# Altium project MotionControlBoard.PrjPcb
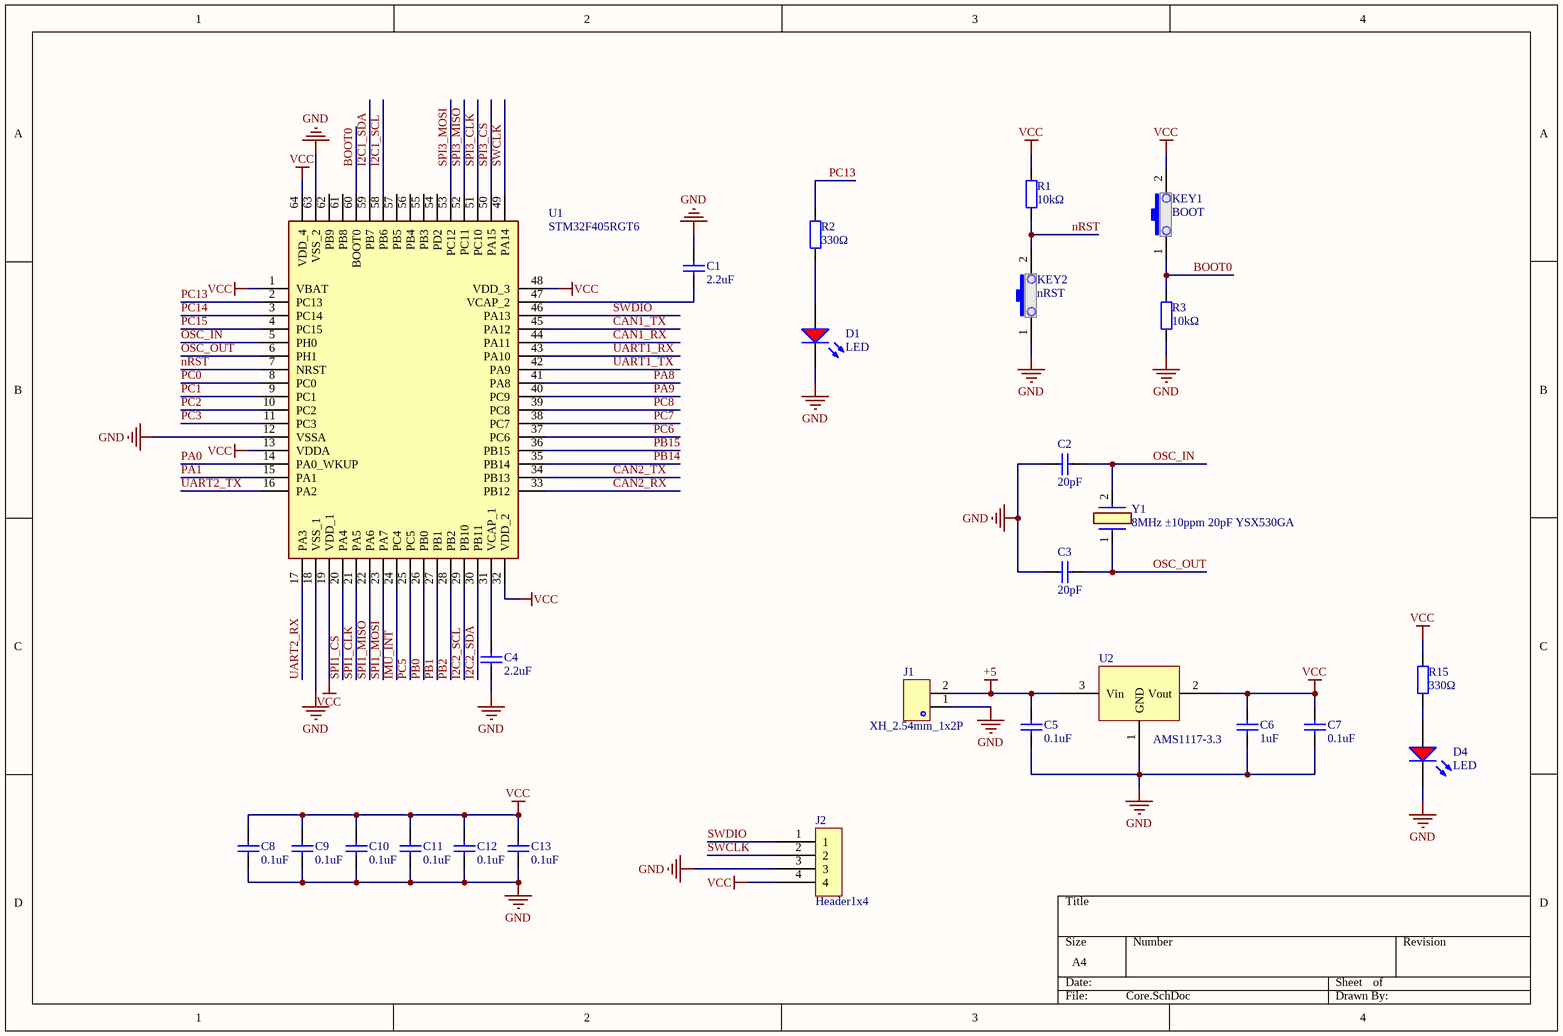
[diagram p0: Core.SchDoc]
3 sheets, 72 parts. Net scope: global (net labels, ports and power ports of the same name join across sheets).
Board file: MotionControlBoard.PcbDoc
Sheets:
  Core.SchDoc
  IMU.SchDoc
  Peripherals.SchDoc

## Sheet Core.SchDoc
size A4; SheetNumber: 1; SheetTotal: 3

### Parts
C1  2.2uF  [C0603]
C2  20pF  [C0603]
C3  20pF  [C0603]
C4  2.2uF  [C0603]
C5  0.1uF  [C0603]
C6  1uF  [C0603]
C7  0.1uF  [C0603]
C8  0.1uF  [C0603]
C9  0.1uF  [C0603]
C10  0.1uF  [C0603]
C11  0.1uF  [C0603]
C12  0.1uF  [C0603]
C13  0.1uF  [C0603]
D1  LED  [0603_LED_S1]
D4  LED  [0603_LED_S1]
J1  XH_2.54mm_1x2P  [XH2.54mm1x2P弯插]
J2  Header1x4  [Header 1x4p]
KEY1  BOOT  [KEY_3*4]
KEY2  nRST  [KEY_3*4]
R1  10kΩ  [R0603]
R2  330Ω  [R0603]
R3  10kΩ  [R0603]
R15  330Ω  [R0603]
U1  STM32F405RGT6  [QFP50P1200X1200X160-64N]
U2  AMS1117-3.3  [SOT-223]
Y1  8MHz ±10ppm 20pF YSX530GA  [X503212MSB2GI]

### Nets
+5: C5.2 J1.2 U2.3(Vin)
GND: C1.2 C2.2 C3.2 C4.2 C5.1 C6.1 C7.1 C8.1 C9.1 C10.1 C11.1 C12.1 C13.1 D1.K D4.K J1.1 J2.3 KEY2.1 R3.1 U1.12(VSSA) U1.18(VSS_1) U1.63(VSS_2) U2.1(GND)
VCC: C6.2 C7.2 C8.2 C9.2 C10.2 C11.2 C12.2 C13.2 J2.4 KEY1.2 R1.2 R15.1 U1.1(VBAT) U1.13(VDDA) U1.19(VDD_1) U1.32(VDD_2) U1.48(VDD_3) U1.64(VDD_4) U2.2(Vout)
BOOT0: KEY1.1 R3.2 U1.60(BOOT0)
CAN1_RX: U1.44(PA11)
CAN1_TX: U1.45(PA12)
CAN2_RX: U1.33(PB12)
CAN2_TX: U1.34(PB13)
I2C1_SCL: U1.58(PB6)
I2C1_SDA: U1.59(PB7)
I2C2_SCL: U1.29(PB10)
I2C2_SDA: U1.30(PB11)
IMU_INT: U1.24(PC4)
nRST: KEY2.2 R1.1 U1.7(NRST)
OSC_IN: C2.1 U1.5(PH0) Y1.2
OSC_OUT: C3.1 U1.6(PH1) Y1.1
PA0: U1.14(PA0_WKUP)
PA1: U1.15(PA1)
PA8: U1.41(PA8)
PA9: U1.40(PC9)
PB0: U1.26(PB0)
PB1: U1.27(PB1)
PB2: U1.28(PB2)
PB14: U1.35(PB14)
PB15: U1.36(PB15)
PC0: U1.8(PC0)
PC1: U1.9(PC1)
PC2: U1.10(PC2)
PC3: U1.11(PC3)
PC5: U1.25(PC5)
PC6: U1.37(PC6)
PC7: U1.38(PC7)
PC8: U1.39(PC8)
PC13: R2.1 U1.2(PC13)
PC14: U1.3(PC14)
PC15: U1.4(PC15)
SPI1_CLK: U1.21(PA5)
SPI1_CS: U1.20(PA4)
SPI1_MISO: U1.22(PA6)
SPI1_MOSI: U1.23(PA7)
SPI3_CLK: U1.51(PC10)
SPI3_CS: U1.50(PA15)
SPI3_MISO: U1.52(PC11)
SPI3_MOSI: U1.53(PC12)
SWCLK: J2.2 U1.49(PA14)
SWDIO: J2.1 U1.46(PA13)
UART1_RX: U1.43(PA10)
UART1_TX: U1.42(PA9)
UART2_RX: U1.17(PA3)
UART2_TX: U1.16(PA2)
NetC1_1: C1.1 U1.47(VCAP_2)
NetC4_1: C4.1 U1.31(VCAP_1)
NetD1_A: D1.A R2.2
NetD4_A: D4.A R15.2

Not connected (* = marked no-connect by the designer): U1 54(PD2) 55(PB3) 56(PB4) 57(PB5) 61(PB8) 62(PB9)

### Library data of the parts
C1-C13 = Capacitor
D1 D4 = 0603 红灯: 发光二极管; ComponentLink1Description: 供应商链接; ComponentLink1URL: http://www.szlcsc.com/product/details_2659.html; Package: 0603; Supplier: LC; SuppliersPartNumber: C2286
KEY1 KEY2 = KEY_3*4: C707339
R1-R3 R15 = Resistor
U1 = STM32F405RGT6TR: Integrated Circuit; Manufacturer_Name: STMicroelectronics; Datasheet Link: http://www.st.com/web/en/resource/technical/document/datasheet/DM00037051.pdf; Height: 1.6mm; Manufacturer_Part_Number: STM32F405RGT6TR; Mouser Part Number: 511-STM32F405RGT6TR; Mouser Price/Stock: https://www.mouser.co.uk/ProductDetail/STMicroelectronics/STM32F405RGT6TR?qs=MavH1QghrkHshpR6GkvPIg%3D%3D; Arrow Part Number: STM32F405RGT6TR; Arrow Price/Stock: https://www.arrow.com/en/products/stm32f405rgt6tr/stmicroelectronics?region=nac
U2 = AMS1117-3.3: C347222
Y1 = X503212MSB2GI: Crystal or Oscillator; Manufacturer_Name: Yangxing Tech; Datasheet Link: https://datasheet.lcsc.com/szlcsc/Yangxing-Tech-X503212MSB2GI_C112573.pdf; Height: 1.35mm; Manufacturer_Part_Number: X503212MSB2GI

## Sheet IMU.SchDoc
size A4; SheetNumber: 2; SheetTotal: 3
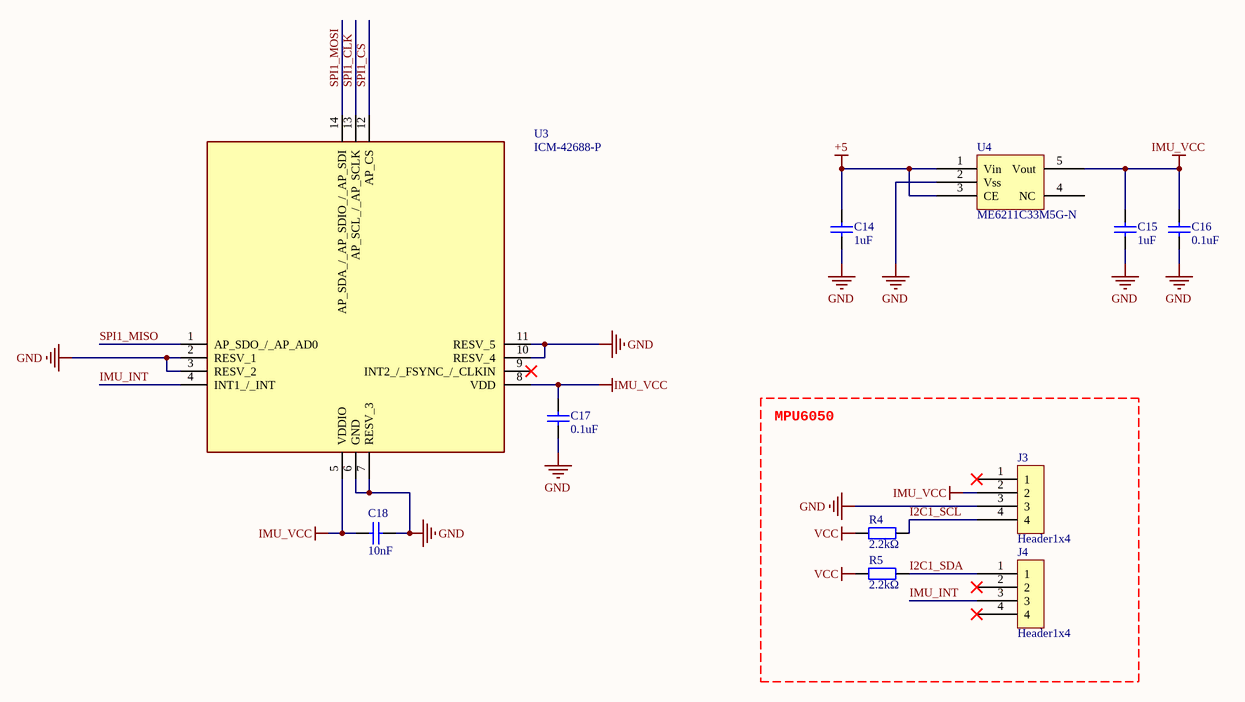
[diagram p1: IMU.SchDoc]

### Parts
C14  1uF  [C0603]
C15  1uF  [C0603]
C16  0.1uF  [C0603]
C17  0.1uF  [C0603]
C18  10nF  [C0603]
J3  Header1x4  [Header 1x4p]
J4  Header1x4  [Header 1x4p]
R4  2.2kΩ  [R0603]
R5  2.2kΩ  [R0603]
U3  ICM-42688-P  [IIM42352]
U4  ME6211C33M5G-N  [SOT-23-5]

### Blocks framed on the sheet
MPU6050: J3 J4 R4 R5

### Nets
+5: C14.2 U4.1(Vin) U4.3(CE)
GND: C14.1 C15.1 C16.1 C17.1 C18.1 J3.3 U3.2(RESV_1) U3.3(RESV_2) U3.6(GND) U3.7(RESV_3) U3.10(RESV_4) U3.11(RESV_5) U4.2(Vss)
IMU_VCC: C15.2 C16.2 C17.2 C18.2 J3.2 U3.5(VDDIO) U3.8(VDD) U4.5(Vout)
VCC: R4.2 R5.2
I2C1_SCL: J3.4 R4.1
I2C1_SDA: J4.1 R5.1
IMU_INT: J4.3 U3.4(INT1_/_INT)
SPI1_CLK: U3.13(AP_SCL_/_AP_SCLK)
SPI1_CS: U3.12(AP_CS)
SPI1_MISO: U3.1(AP_SDO_/_AP_AD0)
SPI1_MOSI: U3.14(AP_SDA_/_AP_SDIO_/_AP_SDI)

Not connected (* = marked no-connect by the designer): J3 1*; J4 2* 4*; U3 9(INT2_/_FSYNC_/_CLKIN)*; U4 4(NC)

### Library data of the parts
C14-C18 = Capacitor
R4 R5 = Resistor
U3 = ICM-42688-P: Integrated Circuit; Manufacturer_Name: TDK; Datasheet Link: https://3cfeqx1hf82y3xcoull08ihx-wpengine.netdna-ssl.com/wp-content/uploads/2021/06/DS-000347-ICM-42688-P-v1.5.pdf; Manufacturer_Part_Number: ICM-42688-P; Mouser Part Number: 410-ICM-42688-P; Mouser Price/Stock: https://www.mouser.co.uk/ProductDetail/TDK-InvenSense/ICM-42688-P?qs=OlC7AqGiEDk8QrNAV728zw%3D%3D; Arrow Part Number: ICM-42688-P; Arrow Price/Stock: https://www.arrow.com/en/products/icm-42688-p/invensense?region=nac
U4 = ME6211C33M5G-N: C82942

## Sheet Peripherals.SchDoc
size A4; SheetNumber: 3; SheetTotal: 3
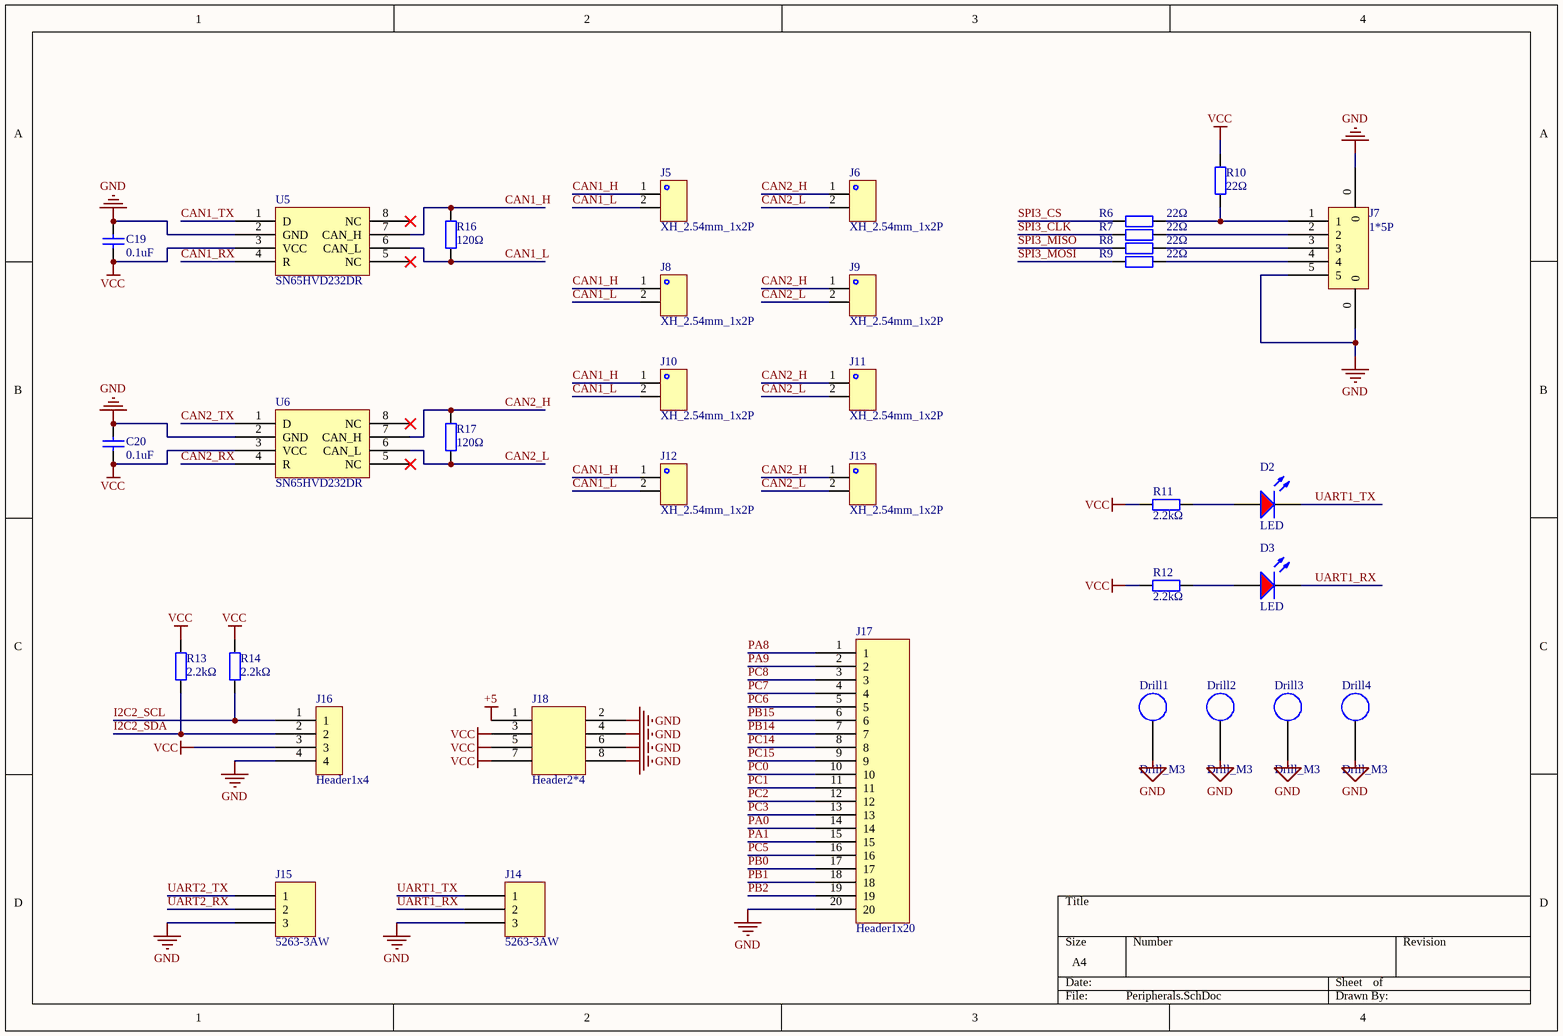
[diagram p2: Peripherals.SchDoc]

### Parts
C19  0.1uF  [C0603]
C20  0.1uF  [C0603]
D2  LED  [0603_LED_S1]
D3  LED  [0603_LED_S1]
Drill1  Drill_M3  [Drill_M_3]
Drill2  Drill_M3  [Drill_M_3]
Drill3  Drill_M3  [Drill_M_3]
Drill4  Drill_M3  [Drill_M_3]
J5  XH_2.54mm_1x2P  [XH2.54mm1x2P弯插]
J6  XH_2.54mm_1x2P  [XH2.54mm1x2P弯插]
J7  1*5P  [1.0T-5P]
J8  XH_2.54mm_1x2P  [XH2.54mm1x2P弯插]
J9  XH_2.54mm_1x2P  [XH2.54mm1x2P弯插]
J10  XH_2.54mm_1x2P  [XH2.54mm1x2P弯插]
J11  XH_2.54mm_1x2P  [XH2.54mm1x2P弯插]
J12  XH_2.54mm_1x2P  [XH2.54mm1x2P弯插]
J13  XH_2.54mm_1x2P  [XH2.54mm1x2P弯插]
J14  5263-3AW  [5264-3AW]
J15  5263-3AW  [5264-3AW]
J16  Header1x4  [Header 1x4p]
J17  Header1x20  [Header1x20]
J18  Header2*4  [Header2*4]
R6  22Ω  [R0603]
R7  22Ω  [R0603]
R8  22Ω  [R0603]
R9  22Ω  [R0603]
R10  22Ω  [R0603]
R11  2.2kΩ  [R0603]
R12  2.2kΩ  [R0603]
R13  2.2kΩ  [R0603]
R14  2.2kΩ  [R0603]
R16  120Ω  [R0603]
R17  120Ω  [R0603]
U5  SN65HVD232DR  [SOIC-8_150mil]
U6  SN65HVD232DR  [SOIC-8_150mil]

### Nets
+5: J18.1(A)
GND: C19.2 C20.2 Drill1.0(A) Drill2.0(A) Drill3.0(A) Drill4.0(A) J7.0 J7.5 J14.3 J15.3 J16.4 J17.20 J18.2(A) J18.4(A) J18.6(A) J18.8(A) U5.2(GND) U6.2(GND)
VCC: C19.1 C20.1 J16.3 J18.3(A) J18.5(A) J18.7(A) R10.2 R11.1 R12.1 R13.2 R14.2 U5.3(VCC) U6.3(VCC)
CAN1_H: J5.1 J8.1 J10.1 J12.1 R16.1 U5.7(CAN_H)
CAN1_L: J5.2 J8.2 J10.2 J12.2 R16.2 U5.6(CAN_L)
CAN1_RX: U5.4(R)
CAN1_TX: U5.1(D)
CAN2_H: J6.1 J9.1 J11.1 J13.1 R17.1 U6.7(CAN_H)
CAN2_L: J6.2 J9.2 J11.2 J13.2 R17.2 U6.6(CAN_L)
CAN2_RX: U6.4(R)
CAN2_TX: U6.1(D)
I2C2_SCL: J16.1 R14.1
I2C2_SDA: J16.2 R13.1
PA0: J17.14
PA1: J17.15
PA8: J17.1
PA9: J17.2
PB0: J17.17
PB1: J17.18
PB2: J17.19
PB14: J17.7
PB15: J17.6
PC0: J17.10
PC1: J17.11
PC2: J17.12
PC3: J17.13
PC5: J17.16
PC6: J17.5
PC7: J17.4
PC8: J17.3
PC14: J17.8
PC15: J17.9
SPI3_CLK: R7.2
SPI3_CS: R6.2
SPI3_MISO: R8.2
SPI3_MOSI: R9.2
UART1_RX: D3.K J14.2
UART1_TX: D2.K J14.1
UART2_RX: J15.2
UART2_TX: J15.1
NetD2_A: D2.A R11.2
NetD3_A: D3.A R12.2
NetJ7_1: J7.1 R6.1 R10.1
NetJ7_2: J7.2 R7.1
NetJ7_3: J7.3 R8.1
NetJ7_4: J7.4 R9.1

Not connected (* = marked no-connect by the designer): U5 5(NC)* 8(NC)*; U6 5(NC)* 8(NC)*

### Library data of the parts
C19 C20 = Capacitor
D2 D3 = 0603 红灯: 发光二极管; ComponentLink1Description: 供应商链接; ComponentLink1URL: http://www.szlcsc.com/product/details_2659.html; Package: 0603; Supplier: LC; SuppliersPartNumber: C2286
J7 = 插座 1*5P 卧贴: C145957
J18 = Header2*4: C124386
R6-R14 R16 R17 = Resistor
U5 U6 = SN65HVD232DR: C30530

## Nets that join several sheets
+5: Core (C5.2 J1.2 U2.3), IMU (C14.2 U4.1 U4.3), Peripherals (J18.1)
GND: Core (23 pins), IMU (13 pins), Peripherals (18 pins)
VCC: Core (19 pins), IMU (R4.2 R5.2), Peripherals (13 pins)
CAN1_RX: Core (U1.44), Peripherals (U5.4)
CAN1_TX: Core (U1.45), Peripherals (U5.1)
CAN2_RX: Core (U1.33), Peripherals (U6.4)
CAN2_TX: Core (U1.34), Peripherals (U6.1)
I2C1_SCL: Core (U1.58), IMU (J3.4 R4.1)
I2C1_SDA: Core (U1.59), IMU (J4.1 R5.1)
I2C2_SCL: Core (U1.29), Peripherals (J16.1 R14.1)
I2C2_SDA: Core (U1.30), Peripherals (J16.2 R13.1)
IMU_INT: Core (U1.24), IMU (J4.3 U3.4)
PA0: Core (U1.14), Peripherals (J17.14)
PA1: Core (U1.15), Peripherals (J17.15)
PA8: Core (U1.41), Peripherals (J17.1)
PA9: Core (U1.40), Peripherals (J17.2)
PB0: Core (U1.26), Peripherals (J17.17)
PB1: Core (U1.27), Peripherals (J17.18)
PB2: Core (U1.28), Peripherals (J17.19)
PB14: Core (U1.35), Peripherals (J17.7)
PB15: Core (U1.36), Peripherals (J17.6)
PC0: Core (U1.8), Peripherals (J17.10)
PC1: Core (U1.9), Peripherals (J17.11)
PC2: Core (U1.10), Peripherals (J17.12)
PC3: Core (U1.11), Peripherals (J17.13)
PC5: Core (U1.25), Peripherals (J17.16)
PC6: Core (U1.37), Peripherals (J17.5)
PC7: Core (U1.38), Peripherals (J17.4)
PC8: Core (U1.39), Peripherals (J17.3)
PC14: Core (U1.3), Peripherals (J17.8)
PC15: Core (U1.4), Peripherals (J17.9)
SPI1_CLK: Core (U1.21), IMU (U3.13)
SPI1_CS: Core (U1.20), IMU (U3.12)
SPI1_MISO: Core (U1.22), IMU (U3.1)
SPI1_MOSI: Core (U1.23), IMU (U3.14)
SPI3_CLK: Core (U1.51), Peripherals (R7.2)
SPI3_CS: Core (U1.50), Peripherals (R6.2)
SPI3_MISO: Core (U1.52), Peripherals (R8.2)
SPI3_MOSI: Core (U1.53), Peripherals (R9.2)
UART1_RX: Core (U1.43), Peripherals (D3.K J14.2)
UART1_TX: Core (U1.42), Peripherals (D2.K J14.1)
UART2_RX: Core (U1.17), Peripherals (J15.2)
UART2_TX: Core (U1.16), Peripherals (J15.1)